# Altium schematic sheet fpga-power.SchDoc: FPGA - Power
size Legal; CheckedBy: J. Brinton; CompanyName: Signal Laboratories, Inc.; DrawnBy: J. Brinton; Engineer: J. Brinton; Address1: 3479 Edison Way; Address2: Menlo Park CA 94025; Address3: +1 (877) 778-8435; Address4: siglabs.com; DocumentNumber: 37; Revision: 2b; SheetNumber: 38; SheetTotal: 58
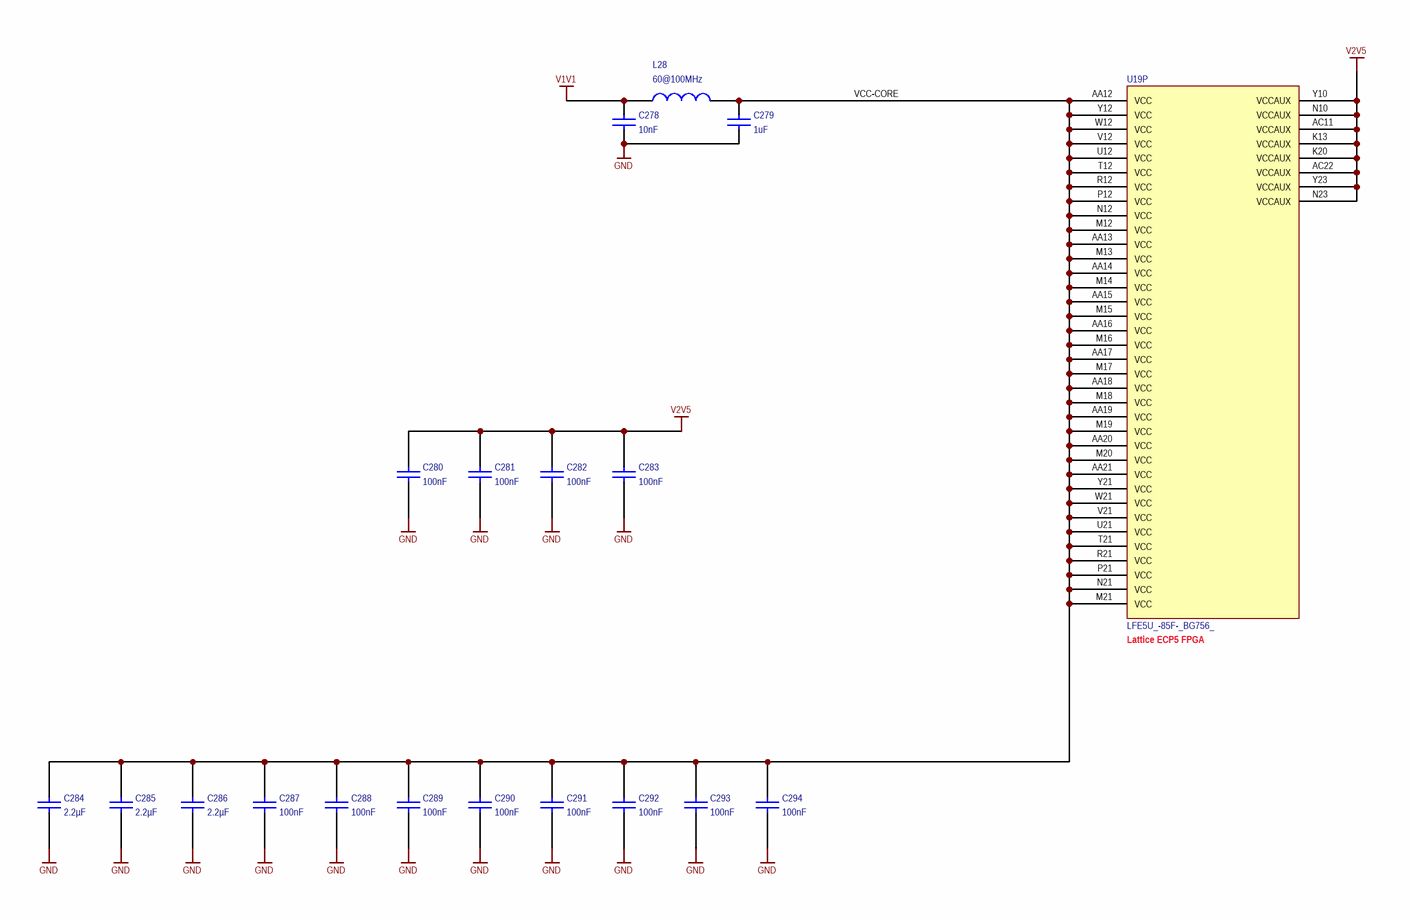
[diagram p0: fpga-power.SchDoc]

## Parts
C278  value 10nF  [0402]  (hidden comment: GRM155R71E103KA01D)
C279  value 1uF  [0402]  (hidden comment: GRM155R61A105KE15D)
C280  value 100nF  [CAPC1005X56N]  (hidden comment: GRM155R71C104KA88J)
C281  value 100nF  [CAPC1005X56N]  (hidden comment: GRM155R71C104KA88J)
C282  value 100nF  [CAPC1005X56N]  (hidden comment: GRM155R71C104KA88J)
C283  value 100nF  [CAPC1005X56N]  (hidden comment: GRM155R71C104KA88J)
C284  value 2.2µF  [CAPC1608X90N]  (hidden comment: GRM21BR71C225KA12L)
C285  value 2.2µF  [CAPC1608X90N]  (hidden comment: GRM21BR71C225KA12L)
C286  value 2.2µF  [CAPC1608X90N]  (hidden comment: GRM21BR71C225KA12L)
C287  value 100nF  [CAPC1005X56N]  (hidden comment: GRM155R71C104KA88J)
C288  value 100nF  [CAPC1005X56N]  (hidden comment: GRM155R71C104KA88J)
C289  value 100nF  [CAPC1005X56N]  (hidden comment: GRM155R71C104KA88J)
C290  value 100nF  [CAPC1005X56N]  (hidden comment: GRM155R71C104KA88J)
C291  value 100nF  [CAPC1005X56N]  (hidden comment: GRM155R71C104KA88J)
C292  value 100nF  [CAPC1005X56N]  (hidden comment: GRM155R71C104KA88J)
C293  value 100nF  [CAPC1005X56N]  (hidden comment: GRM155R71C104KA88J)
C294  value 100nF  [CAPC1005X56N]  (hidden comment: GRM155R71C104KA88J)
L28  value 60@100MHz  [0402]  (hidden comment: BLM15PX600SN1D)
U19  LFE5U_-85F-_BG756_  [caBGA756]  (part P of 19)

## Nets
GND: C278.1 C279.1 C280.1 C281.1 C282.1 C283.1 C284.1 C285.1 C286.1 C287.1 C288.1 C289.1 C290.1 C291.1 C292.1 C293.1 C294.1
V1V1: C278.2 L28.1
V2V5: C280.2 C281.2 C282.2 C283.2 U19.AC11(VCCAUX) U19.AC22(VCCAUX) U19.K13(VCCAUX) U19.K20(VCCAUX) U19.N10(VCCAUX) U19.N23(VCCAUX) U19.Y10(VCCAUX) U19.Y23(VCCAUX)
VCC-CORE: C279.2 C284.2 C285.2 C286.2 C287.2 C288.2 C289.2 C290.2 C291.2 C292.2 C293.2 C294.2 L28.2 U19.AA12(VCC) U19.AA13(VCC) U19.AA14(VCC) U19.AA15(VCC) U19.AA16(VCC) U19.AA17(VCC) U19.AA18(VCC) U19.AA19(VCC) U19.AA20(VCC) U19.AA21(VCC) U19.M12(VCC) U19.M13(VCC) U19.M14(VCC) U19.M15(VCC) U19.M16(VCC) U19.M17(VCC) U19.M18(VCC) U19.M19(VCC) U19.M20(VCC) U19.M21(VCC) U19.N12(VCC) U19.N21(VCC) U19.P12(VCC) U19.P21(VCC) U19.R12(VCC) U19.R21(VCC) U19.T12(VCC) U19.T21(VCC) U19.U12(VCC) U19.U21(VCC) U19.V12(VCC) U19.V21(VCC) U19.W12(VCC) U19.W21(VCC) U19.Y12(VCC) U19.Y21(VCC)

## Notes on the sheet
- (near U19) Lattice ECP5 FPGA
- Title
- Engineer
- Revision
- Drawn By
- Checked By
- Date
- Sheet
- of

## Library data of the parts
C278 = CAP 0402: Ceramic Capacitor 10nF ±10% 25V X7R 0402; Manufacturer: Murata; Tr: -55:125; Voltage: 25V; Manufacturer P/N: GRM155R71E103KA01D; Package: 0402; Tolerance: ±10%
C279 = CAP 0402: Ceramic Capacitor 1uF ±10% 10V X5R 0402; Manufacturer: Murata; Tr: -55:125; Voltage: 10V; Manufacturer P/N: GRM155R61A105KE15D; Package: 0402; Tolerance: ±10%
C280-C283 C287-C294 = GRM155R71A104KA01J: Ceramic Capacitor 100nF ±10% 16V X7R 0402; Manufacturer: Murata; Tr: -55:125; Manufacturer P/N: GRM155R71C104KA88J; Tolerance: ±10%; Package: 0402; Voltage: 16V
C284-C286 = GRM188R71A225KE15D: Ceramic Capacitor 2.2uF ±10% 10V X7R 0603; Manufacturer: Murata; Tr: -55:125; Manufacturer P/N: GRM188R71A225KE15D; Tolerance: ±10%; Package: 0603; Voltage: 10V
L28 = IND 0402: Ferrite Bead 60-Ohm @ 100MHz 2.5A 0402; Manufacturer: Murata; Tolerance: ±25%; Tr: -55:125; Manufacturer P/N: BLM15PX600SN1D; Package: 0402
U19 = LFE5U_-85F-_BG756_: ECP5 FPGA, 85k LUT, 756-caBGA; Manufacturer: Lattice Semiconductor; Manufacturer P/N: LFE5U_-85F-_BG756_